# Altium project PE2_RC_Tank.PrjPcb
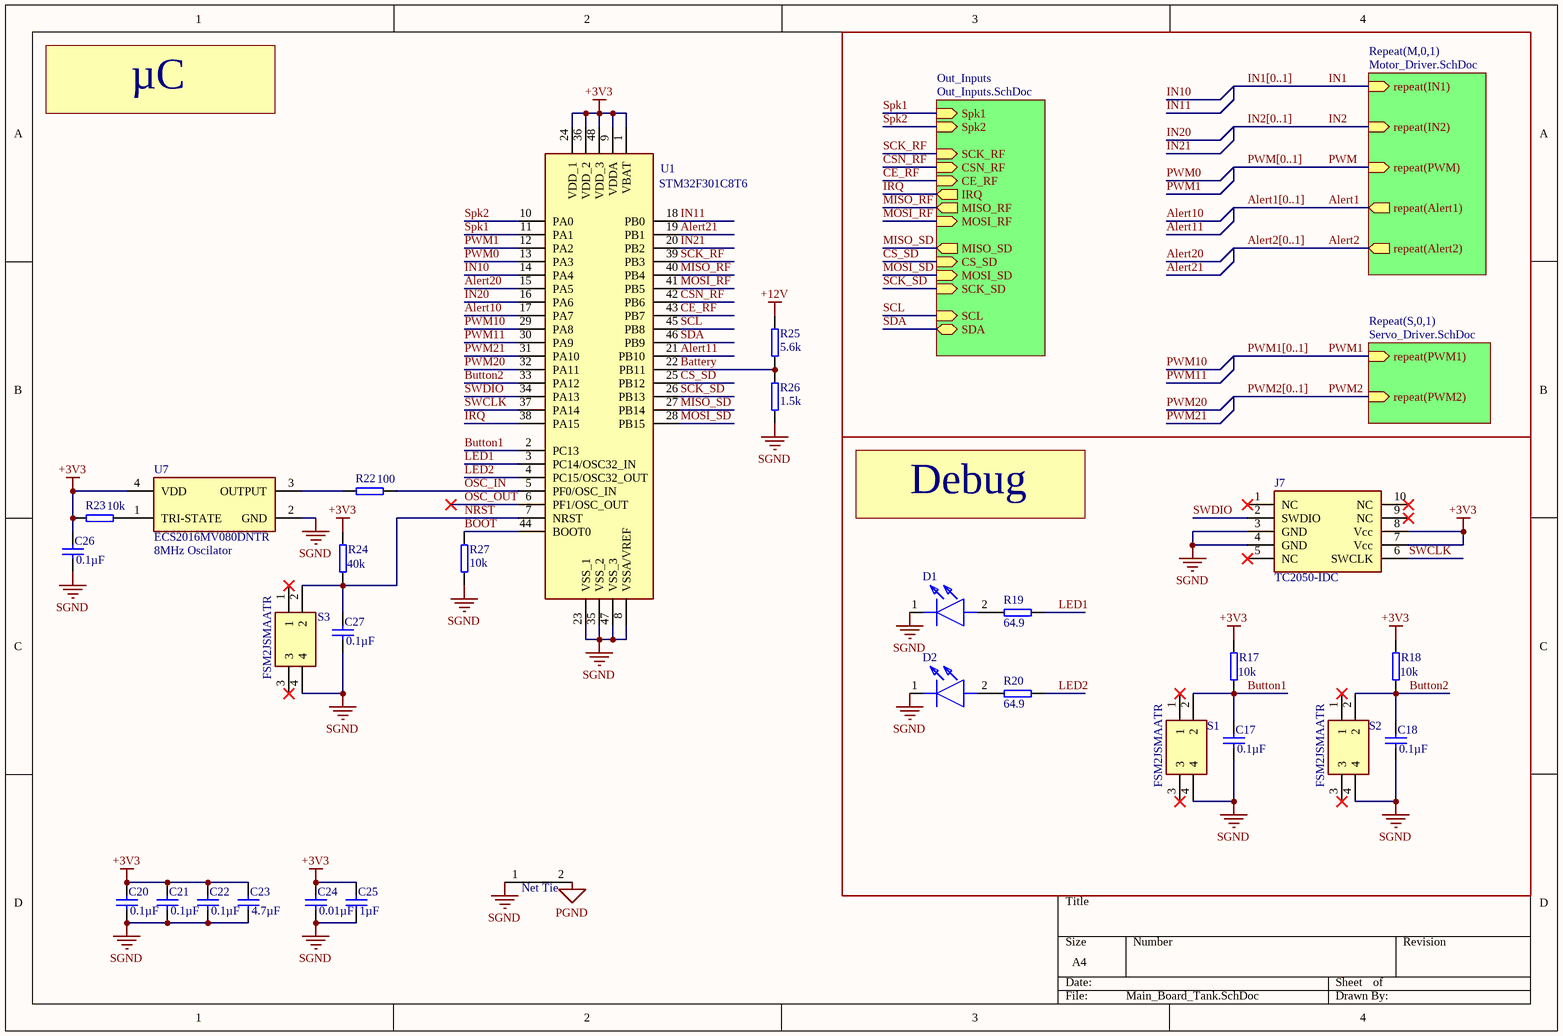
[diagram p0: Main_Board_Tank.SchDoc]
4 sheets, 109 parts. Net scope: hierarchical (ports join the sheet entries above them; power ports are global).
Board file: Tank_PCB.PcbDoc
Sheets:
  Main_Board_Tank.SchDoc
    M0 = Motor_Driver.SchDoc
    M1 = Motor_Driver.SchDoc
    S0 = Servo_Driver.SchDoc
    S1 = Servo_Driver.SchDoc
    Out_Inputs = Out_Inputs.SchDoc

## Sheet Main_Board_Tank.SchDoc
size A4; SheetNumber: 1; SheetTotal: 4

### Parts
C17  0.1µF  [Capacitor 0603]
C18  0.1µF  [Capacitor 0603]
C20  0.1µF  [Capacitor 0603]
C21  0.1µF  [Capacitor 0603]
C22  0.1µF  [Capacitor 0603]
C23  4.7µF  [Capacitor 0603]
C24  0.01µF  [Capacitor 0603]
C25  1µF  [Capacitor 0603]
C26  0.1µF  [Capacitor 0603]
C27  0.1µF  [Capacitor 0603]
D1  LED 1608 (0603) SMD  [INS21AT2G]  (value not drawn)
D2  LED 1608 (0603) SMD  [INS21AT2G]  (value not drawn)
J7  TC2050-IDC  [TAG-CONNECT_TC2050-IDC]
NT1  Net Tie  [Net_Tie]  (net tie, no BOM)
R17  10k  [Resistor 0603]
R18  10k  [Resistor 0603]
R19  64.9  [Resistor 0603]
R20  64.9  [Resistor 0603]
R22  100  [Resistor 0603]
R23  10k  [Resistor 0603]
R24  40k  [Resistor 0603]
R25  5.6k  [Resistor 0603]
R26  1.5k  [Resistor 0603]
R27  10k  [Resistor 0603]
S1  FSM2JSMAATR  [FSM2J_1]
S2  FSM2JSMAATR  [FSM2J_1]
S3  FSM2JSMAATR  [FSM2J_1]
U1  STM32F301C8T6  [QFP50P900X900X160-48N]
U7  ECS2016MV080DNTR  [OSC_ECS-1618-300-BN-TR]

### Blocks framed on the sheet
Debug: C17 C18 D1 D2 J7 R17-R20 S1 S2

### Sub-sheets
Out_Inputs = Out_Inputs.SchDoc: Spk1 (in), Spk2 (in), SCK_RF (in), CSN_RF (in), CE_RF (in), IRQ (out), MISO_RF (out), MOSI_RF (in), MISO_SD (out), CS_SD (in), MOSI_SD (in), SCK_SD (in), SDA (bidir), SCL (in)
Repeat(M,0,1) = Motor_Driver.SchDoc: repeat(IN2) (in), repeat(PWM) (in), repeat(IN1) (in), repeat(Alert1) (out), repeat(Alert2) (out)
Repeat(S,0,1) = Servo_Driver.SchDoc: repeat(PWM1) (in), repeat(PWM2) (in)

### Nets
+3V3: C20.1 C21.1 C22.1 C23.1 C24.1 C25.1 C26.1 J7.7(Vcc) J7.8(Vcc) R17.1 R18.1 R23.2 R24.1 U1.1(VBAT) U1.9(VDDA) U1.24(VDD_1) U1.36(VDD_2) U1.48(VDD_3) U7.4(VDD)
+12V: R25.2
PGND: NT1.2
SGND: C17.2 C18.2 C20.2 C21.2 C22.2 C23.2 C24.2 C25.2 C26.2 C27.2 D1.1(K) D2.1(K) J7.3(GND) J7.4(GND) NT1.1 R26.1 R27.1 S1.4 S2.4 S3.4 U1.8(VSSA/VREF) U1.23(VSS_1) U1.35(VSS_2) U1.47(VSS_3) U7.2(GND)
Alert1: sheet Repeat(M,0,1)/repeat(Alert1)
Alert2: sheet Repeat(M,0,1)/repeat(Alert2)
Alert10: U1.17(PA7)
Alert11: U1.21(PB10)
Alert20: U1.15(PA5)
Alert21: U1.19(PB1)
Battery: R25.1 R26.2 U1.22(PB11)
BOOT: R27.2 U1.44(BOOT0)
Button1: C17.1 R17.2 S1.2 U1.2(PC13)
Button2: C18.1 R18.2 S2.2 U1.33(PA12)
CE_RF: U1.43(PB7) ; sheet Out_Inputs/CE_RF
CS_SD: U1.25(PB12) ; sheet Out_Inputs/CS_SD
CSN_RF: U1.42(PB6) ; sheet Out_Inputs/CSN_RF
IN1: sheet Repeat(M,0,1)/repeat(IN1)
IN2: sheet Repeat(M,0,1)/repeat(IN2)
IN10: U1.14(PA4)
IN11: U1.18(PB0)
IN20: U1.16(PA6)
IN21: U1.20(PB2)
IRQ: U1.38(PA15) ; sheet Out_Inputs/IRQ
LED1: R19.1 U1.3(PC14/OSC32_IN)
LED2: R20.1 U1.4(PC15/OSC32_OUT)
MISO_RF: U1.40(PB4) ; sheet Out_Inputs/MISO_RF
MISO_SD: U1.27(PB14) ; sheet Out_Inputs/MISO_SD
MOSI_RF: U1.41(PB5) ; sheet Out_Inputs/MOSI_RF
MOSI_SD: U1.28(PB15) ; sheet Out_Inputs/MOSI_SD
NRST: C27.1 R24.2 S3.2 U1.7(NRST)
OSC_IN: R22.1 U1.5(PF0/OSC_IN)
OSC_OUT: U1.6(PF1/OSC_OUT)
PWM: sheet Repeat(M,0,1)/repeat(PWM)
PWM0: U1.13(PA3)
PWM1: U1.12(PA2) ; sheet Repeat(S,0,1)/repeat(PWM1)
PWM2: sheet Repeat(S,0,1)/repeat(PWM2)
PWM10: U1.29(PA8)
PWM11: U1.30(PA9)
PWM20: U1.32(PA11)
PWM21: U1.31(PA10)
SCK_RF: U1.39(PB3) ; sheet Out_Inputs/SCK_RF
SCK_SD: U1.26(PB13) ; sheet Out_Inputs/SCK_SD
SCL: U1.45(PB8) ; sheet Out_Inputs/SCL
SDA: U1.46(PB9) ; sheet Out_Inputs/SDA
Spk1: U1.11(PA1) ; sheet Out_Inputs/Spk1
Spk2: U1.10(PA0) ; sheet Out_Inputs/Spk2
SWCLK: J7.6(SWCLK) U1.37(PA14)
SWDIO: J7.2(SWDIO) U1.34(PA13)
NetD1_2: D1.2(A) R19.2
NetD2_2: D2.2(A) R20.2
NetR22_2: R22.2 U7.3(OUTPUT)
NetR23_1: R23.1 U7.1(TRI-STATE)

Not connected (* = marked no-connect by the designer): J7 1(NC)* 5(NC)* 9(NC)* 10(NC)*; S1 1* 3*; S2 1* 3*; S3 1* 3*

### Buses and harness runs
bus Alert1[0..1]
bus Alert2[0..1]
bus IN1[0..1]
bus IN2[0..1]
bus PWM1[0..1]
bus PWM2[0..1]
bus PWM[0..1]

### Notes on the sheet
- µC
- (near U7) 8MHz Oscilator

### Library data of the parts
C17 C18 C20-C27 = Capacitor 0603: Capacitor
J7 = TC2050-IDC: CBL PLUG-OF-NAILS 10-PIN W/LEGS; MF: Tag-Connect LLC; Package: None; Digi-Key_Part_Number: TC2050-IDC-ND; Value: *; MP: TC2050-IDC; SnapEDA_Link: https://www.snapeda.com/parts/TC2050-IDC/Tag-Connect%20LLC/view-part/134529/?ref=snap; Digi-Key_Purchase_URL: https://www.digikey.com/product-detail/en/tag-connect-llc/TC2050-IDC/TC2050-IDC-ND/2605366?utm_source=snapeda&utm_medium=aggregator&utm_campaign=symbol
R17-R20 R22-R27 = Resistor 0603: Resistor
S1-S3 = FSM2JSMAATR: Switch; Manufacturer_Name: TE Connectivity; Datasheet Link: http://www.te.com/commerce/DocumentDelivery/DDEController?Action=showdoc&DocId=Customer+Drawing%7F2-1437565-7%7FV%7Fpdf%7FEnglish%7FENG_CD_2-1437565-7_V.pdf%7F2-1437565-9; Manufacturer_Part_Number: FSM2JSMAATR; Mouser Part Number: 506-FSM2JSMAATR; Mouser Price/Stock: https://www.mouser.co.uk/ProductDetail/TE-Connectivity-Alcoswitch/FSM2JSMAATR?qs=g%252BEszo6zu8MKdISiZRITCQ%3D%3D; Arrow Part Number: FSM2JSMAATR; Arrow Price/Stock: https://www.arrow.com/en/products/fsm2jsmaatr/te-connectivity?region=nac
U1 = STM32F301C8T6: STMICROELECTRONICS - STM32F301C8T6 - MCU, 32BIT, CORTEX-M4, 72MHZ, LQFP-48; Geometry.Height: 1.6mm; Mouser Part Number: 511-STM32F301C8T6; Mouser Price/Stock: https://www.mouser.co.uk/ProductDetail/STMicroelectronics/STM32F301C8T6?qs=DqCdCwOw4%2F52bYCbIDWtEg%3D%3D; Manufacturer_Name: STMicroelectronics; Manufacturer_Part_Number: STM32F301C8T6; Datasheet Link: https://www.st.com/resource/en/datasheet/stm32f301c8.pdf
U7 = ECS-2016MV-250-CN-TR3: 25 MHz XO (Standard) HCMOS Oscillator 1.8V ~ 3.3V Enable/Disable 4-SMD, No Lead; MF: ECS Inc.; SnapEDA_Link: https://www.snapeda.com/parts/ECS-2016MV-250-CN-TR3/ECS+Inc./view-part/?ref=snap; Value: *; Purchase-URL: https://pricing.snapeda.com/search/part/ECS-2016MV-250-CN-TR3/?ref=eda; Check_prices: https://www.snapeda.com/parts/ECS-2016MV-250-CN-TR3/ECS+Inc./view-part/?ref=eda; Availability: In Stock; Price: None; MP: ECS-2016MV-250-CN-TR3; Package: None

## Sheet Motor_Driver.SchDoc
size A4; SheetNumber: 2; SheetTotal: 4
Used 2 times, as channels M0, M1. Parts and nets are listed once, with the designators drawn on the sheet.
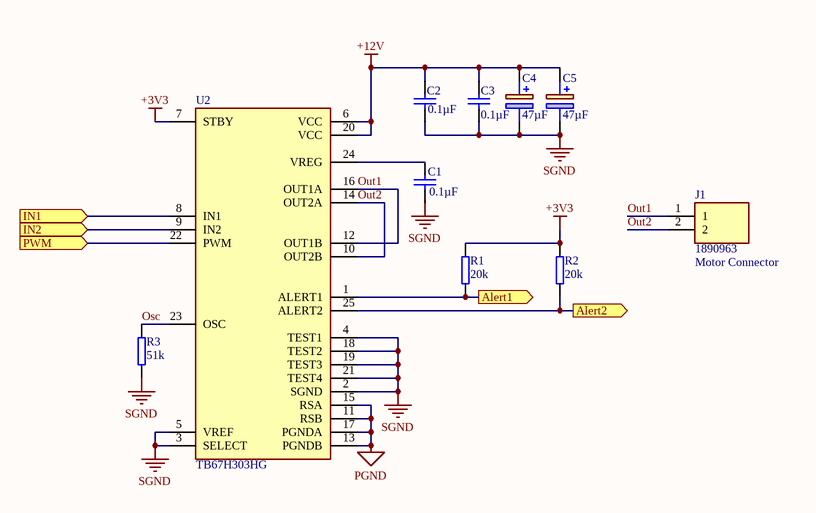
[diagram p1: Motor_Driver.SchDoc]

### Parts
C1  0.1µF  [Capacitor 0603]
C2  0.1µF  [Capacitor 0603]
C3  0.1µF  [Capacitor 0603]
C4  47µF  [CAPAE660X550N]
C5  47µF  [CAPAE660X550N]
J1  1890963  [1890963]
R1  20k  [Resistor 0603]
R2  20k  [Resistor 0603]
R3  51k  [Resistor 0603]
U2  TB67H303HG  [TO100P2930X465X1937-25]

### Ports
Alert1 (out, see Main_Board_Tank[4A]), Alert2 (out, see Main_Board_Tank[4A]), IN1 (in, see Main_Board_Tank[4A]), IN2 (in, see Main_Board_Tank[4A]), PWM (in, see Main_Board_Tank[4A])

### Nets
+3V3: R1.2 R2.2 U2.7(STBY)
+12V: C2.1 C3.1 C4.1(+) C5.1(+) U2.6(VCC) U2.20(VCC)
PGND: U2.11(RSB) U2.13(PGNDB) U2.15(RSA) U2.17(PGNDA)
SGND: C1.2 C2.2 C3.2 C4.2(-) C5.2(-) R3.1 U2.2(SGND) U2.3(SELECT) U2.4(TEST1) U2.5(VREF) U2.18(TEST2) U2.19(TEST3) U2.21(TEST4)
Alert1: R1.1 U2.1(ALERT1) ; port Alert1
Alert2: R2.1 U2.25(ALERT2) ; port Alert2
IN1: U2.8(IN1) ; port IN1
IN2: U2.9(IN2) ; port IN2
Osc: R3.2 U2.23(OSC)
Out1: J1.1 U2.12(OUT1B) U2.16(OUT1A)
Out2: J1.2 U2.10(OUT2B) U2.14(OUT2A)
PWM: U2.22(PWM) ; port PWM
NetC1_1: C1.1 U2.24(VREG)

### Channels
M0: designators end in _M0; ports Alert1=Alert10 Alert2=Alert20 IN1=IN10 IN2=IN20 PWM=PWM0
M1: designators end in _M1; ports Alert1=Alert11 Alert2=Alert21 IN1=IN11 IN2=IN21 PWM=PWM1

### Notes on the sheet
- (near J1) Motor Connector

### Library data of the parts
C1-C3 = Capacitor 0603: Capacitor
C4 C5 = 865080543009: Wurth Elektronik 47uF 35 V dc Aluminium Electrolytic Capacitor, WCAP-ASLI Series 2000h 6.3 (Dia.) x 5.35mm; Geometry.Height: 5.5mm; Mouser Part Number: 710-865080543009; Mouser Price/Stock: https://www.mouser.co.uk/ProductDetail/Wurth-Elektronik/865080543009?qs=0KOYDY2FL2%2F%252BYmhMLtEhDQ%3D%3D; Manufacturer_Name: Wurth Elektronik; Manufacturer_Part_Number: 865080543009; Datasheet Link: https://katalog.we-online.de/pbs/datasheet/865080543009.pdf
J1 = 1890963: Connector: 2pin screw terminal; Manufacturer_Name: Phoenix Contact; Datasheet Link: http://www.phoenixcontact.com/de/produkte/1890963/pdf; Height: 15.15mm; Manufacturer_Part_Number: 1890963; Mouser Part Number: 651-1890963; Mouser Price/Stock: https://www.mouser.co.uk/ProductDetail/Phoenix-Contact/1890963?qs=5W%252BNKB25SvKX6KIA0xFJOA%3D%3D; Arrow Part Number: 1890963; Arrow Price/Stock: https://www.arrow.com/en/products/1890963/phoenix-contact?region=nac
R1-R3 = Resistor 0603: Resistor
U2 = TB67H303HG: Full Bridge

## Sheet Servo_Driver.SchDoc
size A4; SheetNumber: 3; SheetTotal: 4
Used 2 times, as channels S0, S1. Parts and nets are listed once, with the designators drawn on the sheet.
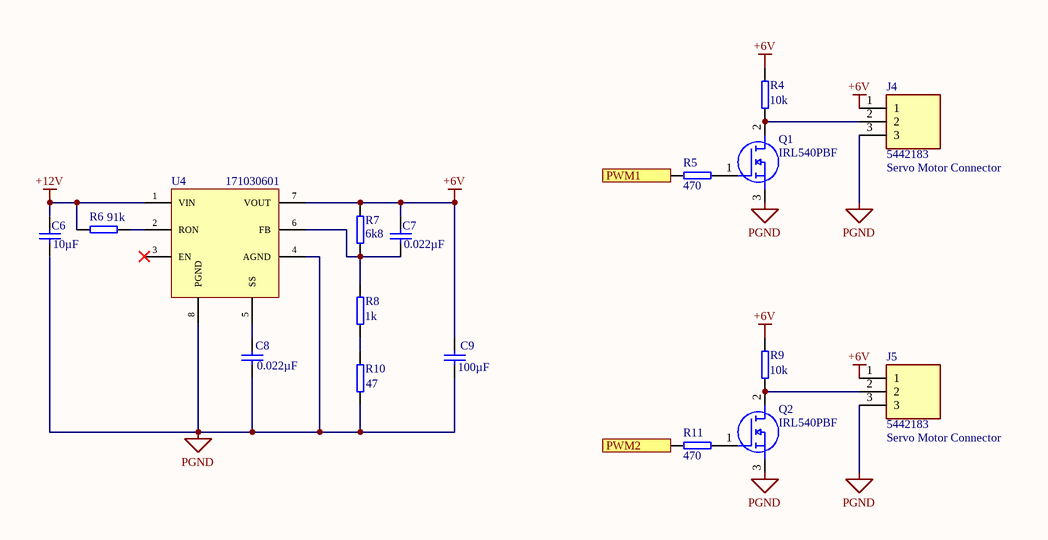
[diagram p2: Servo_Driver.SchDoc]

### Parts
C6  10µF  [Capacitor 0603]
C7  0.022µF  [Capacitor 0603]
C8  0.022µF  [Capacitor 0603]
C9  100µF  [Cap_1210]
J4  5442183  [5442183]
J5  5442183  [5442183]
Q1  IRL540PBF  [TO-220-3]
Q2  IRL540PBF  [TO-220-3]
R4  10k  [Resistor 0603]
R5  470  [Resistor 0603]
R6  91k  [Resistor 0603]
R7  6k8  [Resistor 0603]
R8  1k  [Resistor 0603]
R9  10k  [Resistor 0603]
R10  47  [Resistor 0603]
R11  470  [Resistor 0603]
U4  171030601  [TO263-7EP]

### Ports
PWM1 (in, see Main_Board_Tank[4B]), PWM2 (in, see Main_Board_Tank[4B])

### Nets
+6V: C7.1 C9.2 J4.1 J5.1 R4.1 R7.1 R9.1 U4.7(VOUT)
+12V: C6.1 R6.1 U4.1(VIN)
PGND: C6.2 C8.1 C9.1 J4.3 J5.3 Q1.3(S) Q2.3(S) R10.2 U4.4(AGND) U4.8(PGND)
PWM1: R5.1 ; port PWM1
PWM2: R11.1 ; port PWM2
NetC7_2: C7.2 R7.2 R8.1 U4.6(FB)
NetC8_2: C8.2 U4.5(SS)
NetJ4_2: J4.2 Q1.2(D) R4.2
NetJ5_2: J5.2 Q2.2(D) R9.2
NetQ1_1: Q1.1(G) R5.2
NetQ2_1: Q2.1(G) R11.2
NetR6_2: R6.2 U4.2(RON)
NetR8_2: R8.2 R10.1

Not connected (* = marked no-connect by the designer): U4 3(EN)*

### Channels
S0: designators end in _S0; ports PWM1=PWM10 PWM2=PWM20
S1: designators end in _S1; ports PWM1=PWM11 PWM2=PWM21

### Notes on the sheet
- (near J4) Servo Motor Connector
- (near J5) Servo Motor Connector

### Library data of the parts
C6-C8 = Capacitor 0603: Capacitor
C9 = Capacitor 1210: Capacitor
J4 J5 = 5442183: Connector; Manufacturer_Name: Phoenix Contact; Datasheet Link: http://www.phoenixcontact.net/product/5442183; Height: 10.12mm; Manufacturer_Part_Number: 5442183; Mouser Part Number: 651-5442183; Mouser Price/Stock: https://www.mouser.co.uk/ProductDetail/Phoenix-Contact/5442183?qs=9Y9qB%2FCsC3nrqTUHTUeJoQ%3D%3D; Arrow Part Number: 5442183; Arrow Price/Stock: https://www.arrow.com/en/products/5442183/phoenix-contact?region=nac
Q1 Q2 = IRL540PBF: MOSFET N-CH  100V HEXFET MOSFET; Manufacturer_Name: Vishay; Geometry.Height: 4.65mm; Mouser Part Number: 844-IRL540PBF; Mouser Price/Stock: https://www.mouser.co.uk/ProductDetail/Vishay-Semiconductors/IRL540PBF?qs=cvaI6ThkwxvX4jX2UNqT3g%3D%3D; Manufacturer_Part_Number: IRL540PBF; Datasheet Link: https://componentsearchengine.com/Datasheets/1/IRL540PBF.pdf
R4-R11 = Resistor 0603: Resistor
U4 = CMP-533-000007-A.2: MagI3C-VDRM Variable Step Down Regulator Module, TO263-7EP, 6-42Vin, 3Aout; Manufacturer: Wurth Electronics; Input Voltage: 6-42V; Output Current: 3A; Output Voltage: 0.8-6V; ComponentLink1Description: Manufacturer; ComponentLink1URL: http://www.we-online.de; ComponentLink2Description: Datasheet; ComponentLink2URL: https://katalog.we-online.de/pm/datasheet/171030601.pdf; Mounting Technology: SMT; Operating Temperature: -40 to +125degC; Manufacturer Part Number: 171030601; Packaging: Tape and Reel; Published Date: April 2020; Size: TO263-7EP; Pin Count: 8; Source: MagI3C-VDRM_TO263-7EP.SchLib; Design Item ID: 171030601; Component Type: MagI3C VDRM

## Sheet Out_Inputs.SchDoc
size A4; SheetNumber: 4; SheetTotal: 4
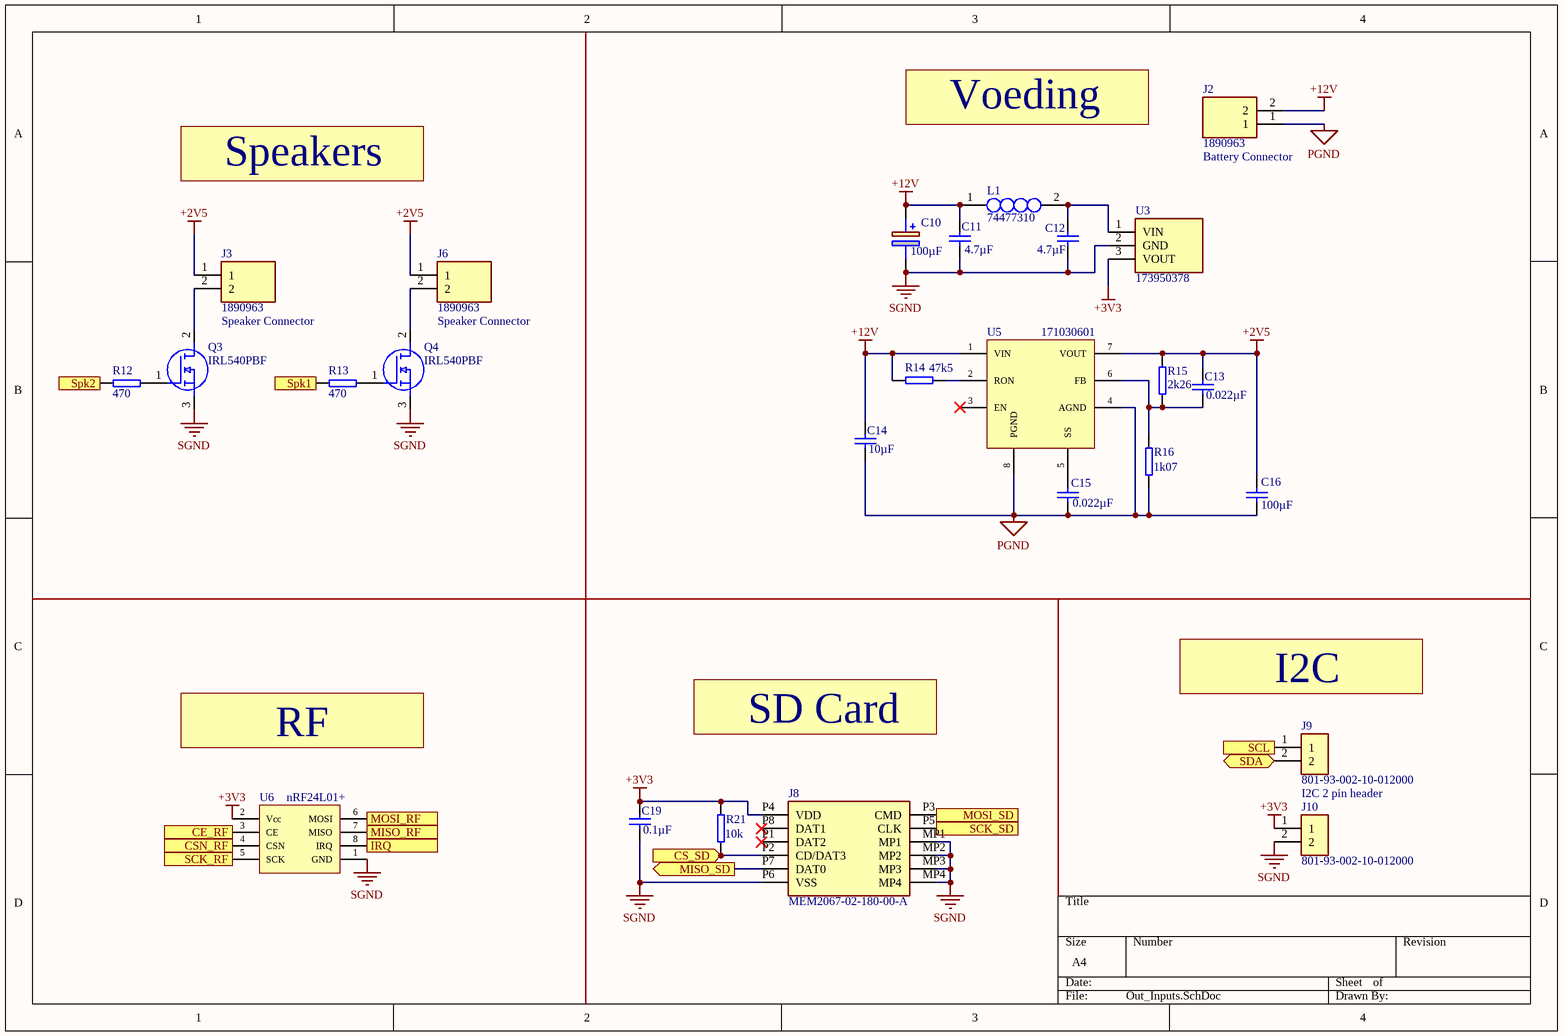
[diagram p3: Out_Inputs.SchDoc]

### Parts
C10  100µF  [CAPPRD350W52D800H1300]
C11  4.7µF  [Capacitor 1206]
C12  4.7µF  [Capacitor 1206]
C13  0.022µF  [Capacitor 0603]
C14  10µF  [Capacitor 0603]
C15  0.022µF  [Capacitor 0603]
C16  100µF  [Cap_1210]
C19  0.1µF  [Capacitor 0603]
J2  1890963  [1890963]
J3  1890963  [1890963]
J6  1890963  [1890963]
J8  MEM2067-02-180-00-A  [MEM20670218000A]
J9  801-93-002-10-012000  [801-93-002-10-012000]
J10  801-93-002-10-012000  [801-93-002-10-012000]
L1  74477310  [WE-PD2_453255]
Q3  IRL540PBF  [TO-220-3]
Q4  IRL540PBF  [TO-220-3]
R12  470  [Resistor 0603]
R13  470  [Resistor 0603]
R14  47k5  [Resistor 0603]
R15  2k26  [Resistor 0603]
R16  1k07  [Resistor 0603]
R21  10k  [Resistor 0603]
U3  173950378  [173950378]
U5  171030601  [TO263-7EP]
U6  nRF24L01+  [nRF24L01+]

### Ports
CE_RF (in, see Main_Board_Tank[3A]), CS_SD (in, see Main_Board_Tank[3B]), CSN_RF (in, see Main_Board_Tank[3A]), IRQ (out, see Main_Board_Tank[3A]), MISO_RF (out, see Main_Board_Tank[3A]), MISO_SD (out, see Main_Board_Tank[3A]), MOSI_RF (in, see Main_Board_Tank[3A]), MOSI_SD (in, see Main_Board_Tank[3B]), SCK_RF (in, see Main_Board_Tank[3A]), SCK_SD (in, see Main_Board_Tank[3B]), SCL (in, see Main_Board_Tank[3B]), SDA (bidir, see Main_Board_Tank[3B]), Spk1 (in, see Main_Board_Tank[3A]), Spk2 (in, see Main_Board_Tank[3A])

### Nets
+2V5: C13.1 C16.2 J3.1 J6.1 R15.1 U5.7(VOUT)
+3V3: C19.1 J8.P4(VDD) J10.1 R21.1 U3.3(VOUT) U6.2(Vcc)
+12V: C10.1(+) C11.1 C14.1 J2.2 L1.1 R14.1 U5.1(VIN)
PGND: C14.2 C15.1 C16.1 J2.1 R16.2 U5.4(AGND) U5.8(PGND)
SGND: C10.2(-) C11.2 C12.2 C19.2 J8.MP1 J8.MP2 J8.MP3 J8.MP4 J8.P6(VSS) J10.2 Q3.3(S) Q4.3(S) U3.2(GND) U6.1(GND)
CE_RF: U6.3(CE) ; port CE_RF
CS_SD: J8.P2(CD/DAT3) R21.2 ; port CS_SD
CSN_RF: U6.4(CSN) ; port CSN_RF
IRQ: U6.8(IRQ) ; port IRQ
MISO_RF: U6.7(MISO) ; port MISO_RF
MISO_SD: J8.P7(DAT0) ; port MISO_SD
MOSI_RF: U6.6(MOSI) ; port MOSI_RF
MOSI_SD: J8.P3(CMD) ; port MOSI_SD
SCK_RF: U6.5(SCK) ; port SCK_RF
SCK_SD: J8.P5(CLK) ; port SCK_SD
SCL: J9.1 ; port SCL
SDA: J9.2 ; port SDA
Spk1: R13.1 ; port Spk1
Spk2: R12.1 ; port Spk2
NetC12_1: C12.1 L1.2 U3.1(VIN)
NetC13_2: C13.2 R15.2 R16.1 U5.6(FB)
NetC15_2: C15.2 U5.5(SS)
NetJ3_2: J3.2 Q3.2(D)
NetJ6_2: J6.2 Q4.2(D)
NetQ3_1: Q3.1(G) R12.2
NetQ4_1: Q4.1(G) R13.2
NetR14_2: R14.2 U5.2(RON)

Not connected (* = marked no-connect by the designer): J8 P1(DAT2)* P8(DAT1)*; U5 3(EN)*

### Notes on the sheet
- Voeding
- Speakers
- (near J2) Battery Connector
- Speaker Connector
- I2C
- RF
- SD Card
- I2C 2 pin header

### Library data of the parts
C10 = 860010674014: Wurth Elektronik 100uF 50 V dc Aluminium Electrolytic Capacitor; Manufacturer_Part_Number: 865080543009; Geometry.Height: 5.5mm; Mouser Part Number: 710-865080543009; Mouser Price/Stock: https://www.mouser.co.uk/ProductDetail/Wurth-Elektronik/865080543009?qs=0KOYDY2FL2%2F%252BYmhMLtEhDQ%3D%3D; Manufacturer_Name: Wurth Elektronik; Datasheet Link: https://katalog.we-online.de/pbs/datasheet/865080543009.pdf; Mouser: 710-860010674014
C11 C12 = Capacitor 1206: Capacitor; Mouser: 710-885012208094
C13-C15 C19 = Capacitor 0603: Capacitor
C16 = Capacitor 1210: Capacitor
J2 J3 J6 = 1890963: as J1 on sheet Motor_Driver; Datasheet Link: http://www.phoenixcontact.com/de/produkte/1890963/pdf; Height: 15.15mm; Manufacturer_Part_Number: 1890963; Mouser Part Number: 651-1890963; Mouser Price/Stock: https://www.mouser.co.uk/ProductDetail/Phoenix-Contact/1890963?qs=5W%252BNKB25SvKX6KIA0xFJOA%3D%3D; Arrow Part Number: 1890963; Arrow Price/Stock: https://www.arrow.com/en/products/1890963/phoenix-contact?region=nac
J8 = MEM2067-02-180-00-A: GCT (GLOBAL CONNECTOR TECHNOLOGY) - MEM2067-02-180-00-A - Memory Socket, MEM2067 Series, Memory Card, 8 Contacts, Copper Alloy, Gold Plated Contacts; Geometry.Height: 1.95mm; Mouser Part Number: 640-MEM20670218000A; Mouser Price/Stock: https://www.mouser.co.uk/ProductDetail/GCT/MEM2067-02-180-00-A?qs=KUoIvG%2F9IlYTw%2Fcc1GlNJA%3D%3D; Manufacturer_Name: GCT (GLOBAL CONNECTOR TECHNOLOGY); Manufacturer_Part_Number: MEM2067-02-180-00-A; Datasheet Link: https://gct.co/files/drawings/mem2067.pdf
J9 J10 = 801-93-002-10-012000: 2 pin header 2.54mm pitch; Mouser: 575-8019300210012000
L1 = 7447730: Inductor; Manufacturer_Name: Wurth Elektronik; Manufacturer_Part_Number: 7447730; Mouser Part Number: 710-7447730; Mouser Price/Stock: https://www.mouser.co.uk/ProductDetail/Wurth-Elektronik/7447730?qs=rS3zZhy2AQMpnsrOMerOTw%3D%3D; Mouser: 710-74477310
Q3 Q4 = IRL540PBF: as Q1 on sheet Servo_Driver; Mouser Part Number: 844-IRL540PBF; Mouser Price/Stock: https://www.mouser.co.uk/ProductDetail/Vishay-Semiconductors/IRL540PBF?qs=cvaI6ThkwxvX4jX2UNqT3g%3D%3D; Manufacturer_Part_Number: IRL540PBF; Datasheet Link: https://componentsearchengine.com/Datasheets/1/IRL540PBF.pdf
R12-R16 R21 = Resistor 0603: Resistor
U3 = 173950378: MagI3C Power Module 0.5A 3.3V 6-28V SIP3; Manufacturer_Name: Wurth Elektronik; Geometry.Height: 11mm; Mouser Part Number: 710-173950378; Mouser Price/Stock: https://www.mouser.co.uk/ProductDetail/Wurth-Elektronik/173950378?qs=SElPoaY2y5Iv2HEnICmd%252BA%3D%3D; Manufacturer_Part_Number: 173950378; Datasheet Link: http://katalog.we-online.de/pm/datasheet/173950378.pdf
U5 = CMP-533-000007-A.2: as U4 on sheet Servo_Driver; ComponentLink1Description: Manufacturer; ComponentLink1URL: http://www.we-online.de; ComponentLink2Description: Datasheet; ComponentLink2URL: https://katalog.we-online.de/pm/datasheet/171030601.pdf; Mounting Technology: SMT; Operating Temperature: -40 to +125degC; Manufacturer Part Number: 171030601; Packaging: Tape and Reel; Published Date: April 2020; Size: TO263-7EP; Pin Count: 8; Source: MagI3C-VDRM_TO263-7EP.SchLib; Design Item ID: 171030601; Component Type: MagI3C VDRM

## Nets that join several sheets
+3V3: Main_Board_Tank (19 pins), M0 (R1_M0.2 R2_M0.2 U2_M0.7), M1 (R1_M1.2 R2_M1.2 U2_M1.7), Out_Inputs (6 pins)
+6V: S0 (8 pins), S1 (8 pins)
+12V: Main_Board_Tank (R25.2), M0 (6 pins), M1 (6 pins), S0 (C6_S0.1 R6_S0.1 U4_S0.1), S1 (C6_S1.1 R6_S1.1 U4_S1.1), Out_Inputs (7 pins)
PGND: Main_Board_Tank (NT1.2), M0 (U2_M0.11 U2_M0.13 U2_M0.15 U2_M0.17), M1 (U2_M1.11 U2_M1.13 U2_M1.15 U2_M1.17), S0 (10 pins), S1 (10 pins), Out_Inputs (7 pins)
SGND: Main_Board_Tank (25 pins), M0 (13 pins), M1 (13 pins), Out_Inputs (14 pins)
Alert10: Main_Board_Tank (U1.17), M0 (R1_M0.1 U2_M0.1)
Alert11: Main_Board_Tank (U1.21), M1 (R1_M1.1 U2_M1.1)
Alert20: Main_Board_Tank (U1.15), M0 (R2_M0.1 U2_M0.25)
Alert21: Main_Board_Tank (U1.19), M1 (R2_M1.1 U2_M1.25)
CE_RF: Main_Board_Tank (U1.43), Out_Inputs (U6.3)
CS_SD: Main_Board_Tank (U1.25), Out_Inputs (J8.P2 R21.2)
CSN_RF: Main_Board_Tank (U1.42), Out_Inputs (U6.4)
IN10: Main_Board_Tank (U1.14), M0 (U2_M0.8)
IN11: Main_Board_Tank (U1.18), M1 (U2_M1.8)
IN20: Main_Board_Tank (U1.16), M0 (U2_M0.9)
IN21: Main_Board_Tank (U1.20), M1 (U2_M1.9)
IRQ: Main_Board_Tank (U1.38), Out_Inputs (U6.8)
MISO_RF: Main_Board_Tank (U1.40), Out_Inputs (U6.7)
MISO_SD: Main_Board_Tank (U1.27), Out_Inputs (J8.P7)
MOSI_RF: Main_Board_Tank (U1.41), Out_Inputs (U6.6)
MOSI_SD: Main_Board_Tank (U1.28), Out_Inputs (J8.P3)
PWM0: Main_Board_Tank (U1.13), M0 (U2_M0.22)
PWM1: Main_Board_Tank (U1.12), M1 (U2_M1.22)
PWM10: Main_Board_Tank (U1.29), S0 (R5_S0.1)
PWM11: Main_Board_Tank (U1.30), S1 (R5_S1.1)
PWM20: Main_Board_Tank (U1.32), S0 (R11_S0.1)
PWM21: Main_Board_Tank (U1.31), S1 (R11_S1.1)
SCK_RF: Main_Board_Tank (U1.39), Out_Inputs (U6.5)
SCK_SD: Main_Board_Tank (U1.26), Out_Inputs (J8.P5)
SCL: Main_Board_Tank (U1.45), Out_Inputs (J9.1)
SDA: Main_Board_Tank (U1.46), Out_Inputs (J9.2)
Spk1: Main_Board_Tank (U1.11), Out_Inputs (R13.1)
Spk2: Main_Board_Tank (U1.10), Out_Inputs (R12.1)